# EAGLE design MotorDriver-rev1 (EAGLE 7.6.0)
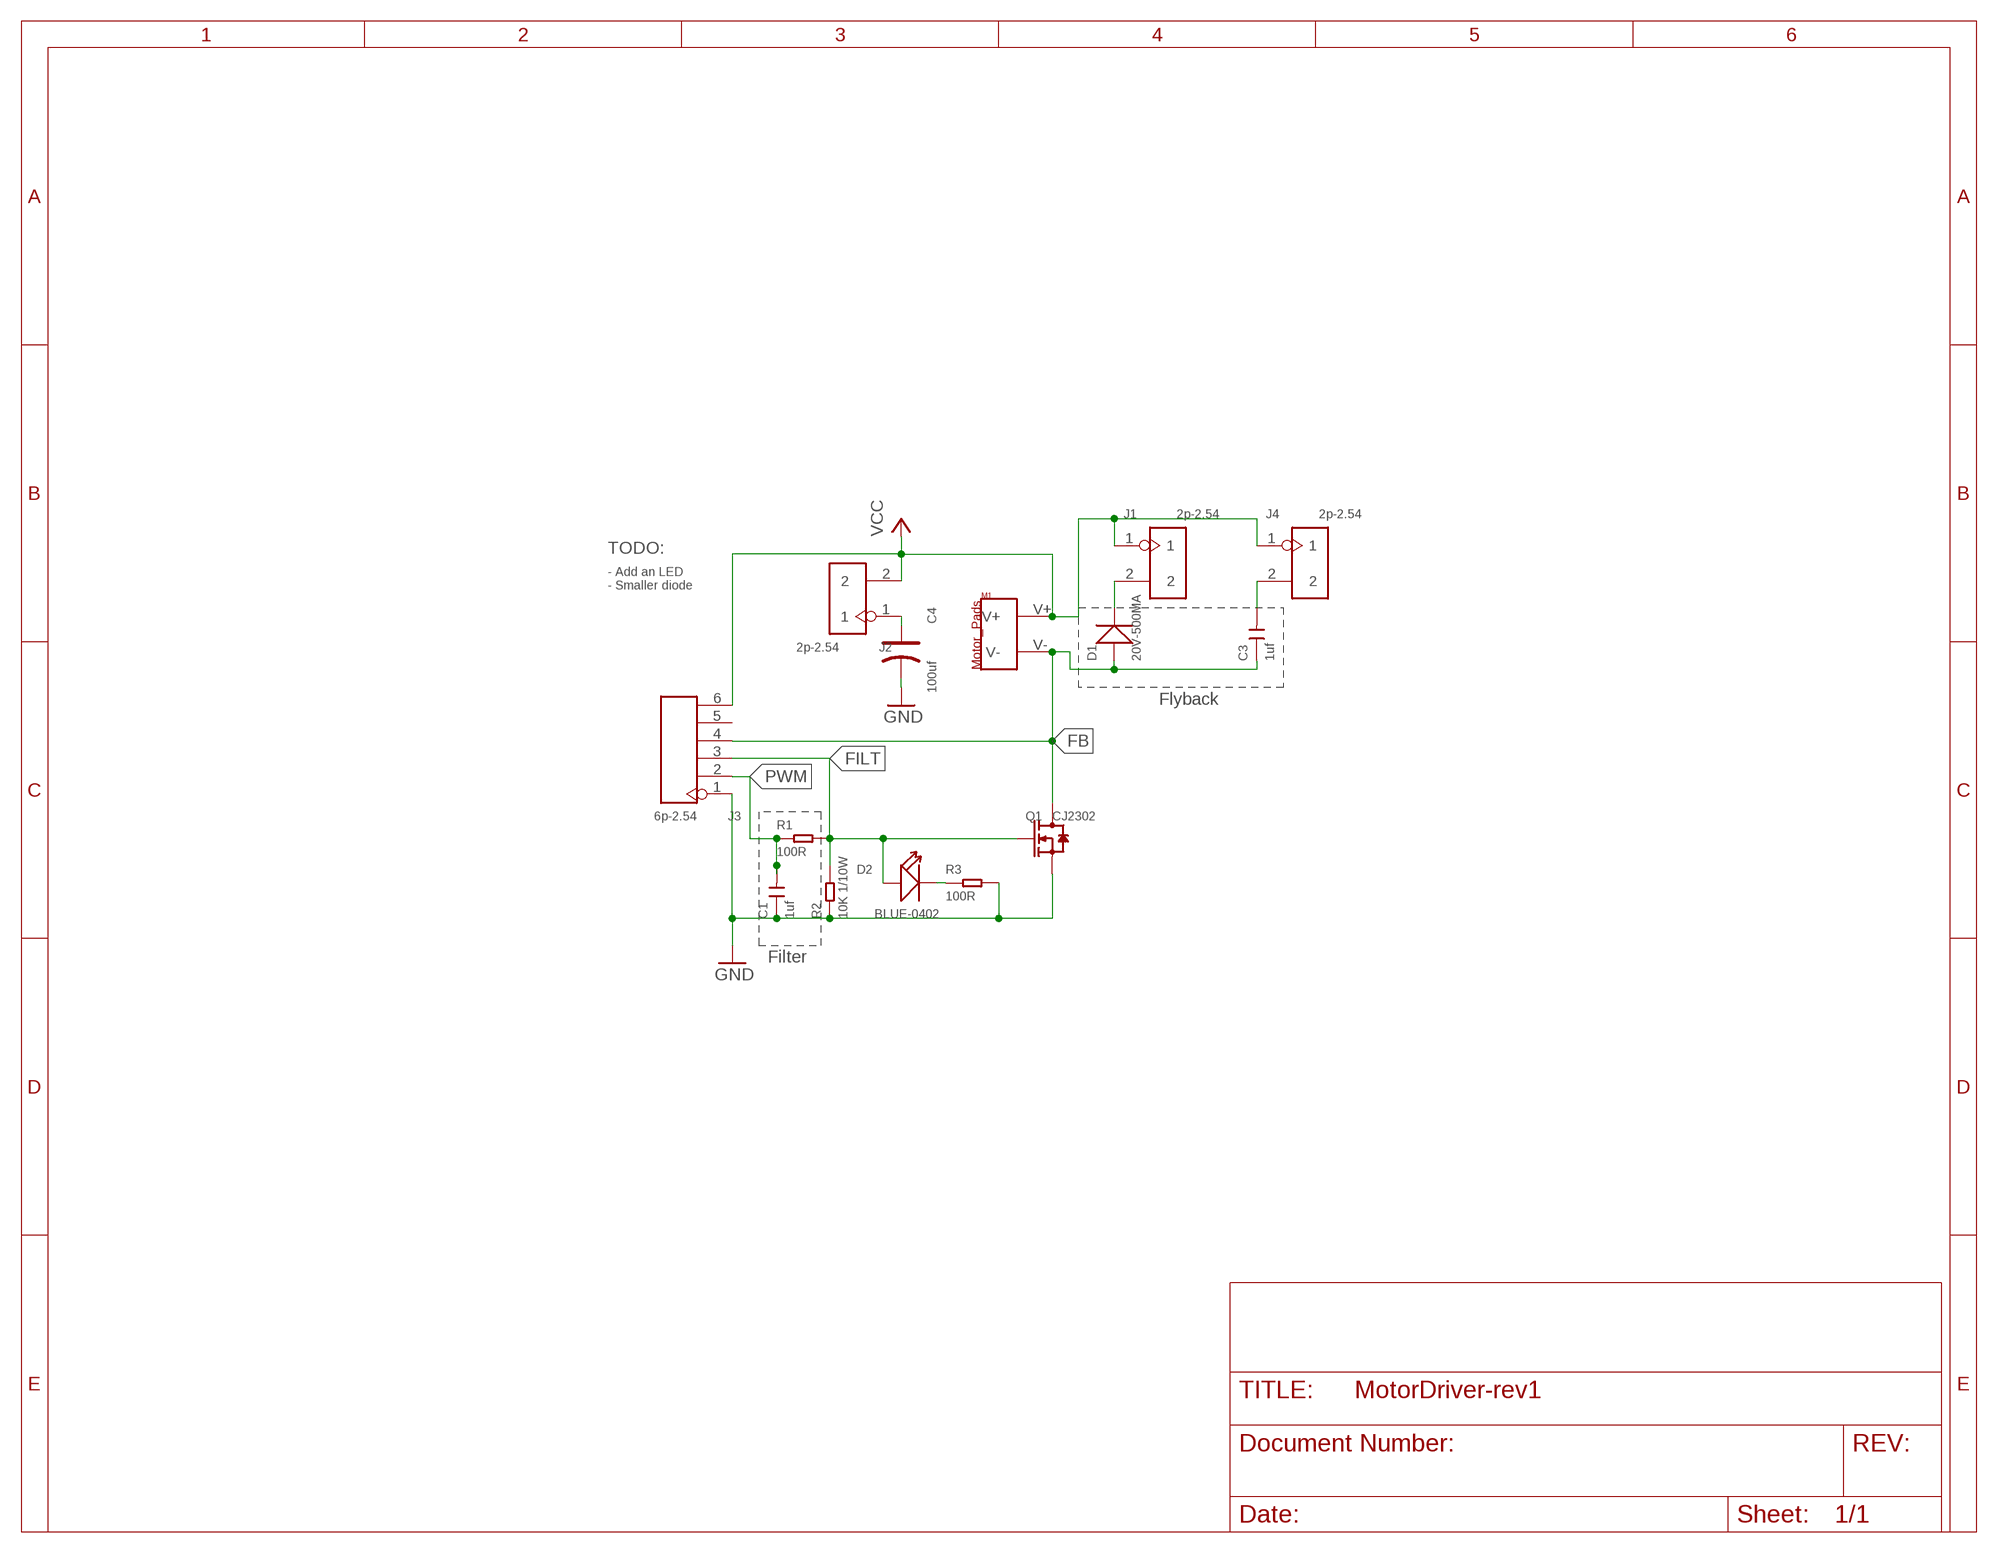
[diagram p0: schematic, sheet 1]

## Parts
C1  1uf  CERAMIC-1UF-10V-10%-X5R(0402)  [C0402]
C3  1uf  CERAMIC-1UF-25V-10%-X7R(0603)  [C0603]
C4  100uf  TANTALUM-SMD-100UF-10V(AVX-B)  [AVX-B]
D1  20V-500MA  SMD-DIODE-SCHOTTKY-20V-500MA(SOD-123)  [SOD-123]
D2  BLUE-0402  SMD-LED-CLEAR-BLUE(0402)  [LED-0402]
J1  2p-2.54  DIP-BLACK-MALE-HEADER-VERT(2P-2.54)  [H2-2.54]
J2  2p-2.54  DIP-BLACK-MALE-HEADER-VERT(2P-2.54)  [H2-2.54]
J3  6p-2.54  DIP-BLACK-MALE-HEADER(6P-2.54)  [H6-2.54]
J4  2p-2.54  DIP-BLACK-MALE-HEADER-VERT(2P-2.54)  [H2-2.54]
M1  MOTOR_PADS  [MOTOR_PADS]
Q1  CJ2302  SMD-MOSFET-N-CH-20V-2.1A-CJ2302(SOT-23)  [SOT-23]
R1  100R  SMD-RES-100R-5%-1/10W(0603)  [R0603]
R2  10K 1/10W  SMD-RES-10K-5%-1/10W(0603)  [R0603]
R3  100R  SMD-RES-100R-5%-1/16W(0402)  [R0402]

## Nets
FB [HighAmps]: C3.1 D1.+ J3.4 M1.V- Q1.3(D)
FILT: D2.+ J3.3 Q1.1(G) R1.2 R2.2
GND [HighAmps]: C1.1 C4.- J3.1 Q1.2(S) R2.1 R3.2
N$1: D2.- R3.1
N$5 [HighAmps]: C4.+ J2.1
N$7 [HighAmps]: D1.- J1.2
N$8 [HighAmps]: C3.2 J4.2
PWM: C1.2 J3.2 R1.1
VCC [HighAmps]: J1.1 J2.2 J3.6 J4.1 M1.V+
Unconnected: J3.5

## Notes on the sheet
- TODO:
- - Add an LED
  - Smaller diode
- Flyback
- Filter

## Library data of the parts
C1 = Seeed-Capacitor-2016:CERAMIC-1UF-10V-10%-X5R(0402): 302010040; MPN: CC0402KRX5R6BB105
C3 = Seeed-Capacitor-2016:CERAMIC-1UF-25V-10%-X7R(0603): 302010139; MPN: CC0603KRX7R8BB105
C4 = Seeed-Capacitor-2016:TANTALUM-SMD-100UF-10V(AVX-B): 302020015; MPN: TAJB107M010#NJ
D1 = Seeed-Diode-2016:SMD-DIODE-SCHOTTKY-20V-500MA(SOD-123): 304020032; MPN: SS0520-7-F
D2 = Seeed-LED-2016:SMD-LED-CLEAR-BLUE(0402): 304090075; MPN: BL-HB337A-AV-TRB
J1 J2 J4 = Seeed-Connector -2016:DIP-BLACK-MALE-HEADER-VERT(2P-2.54): 320020016; MPN: P125-1102A0BS116A1
J3 = Seeed-Connector -2016:DIP-BLACK-MALE-HEADER(6P-2.54): 320020078; MPN: P125-1106A1BS116A1
M1 = Andranik-Lab4:MOTOR_PADS
Q1 = Seeed-Transistor-2016:SMD-MOSFET-N-CH-20V-2.1A-CJ2302(SOT-23): 305030015; MPN: CJ2302
R1 = Seeed-Resistor-2016:SMD-RES-100R-5%-1/10W(0603): 301010090; MPN: RC0603JR-07100RL
R2 = Seeed-Resistor-2016:SMD-RES-10K-5%-1/10W(0603): 301010293; MPN: RC0603JR-0710KL
R3 = Seeed-Resistor-2016:SMD-RES-100R-5%-1/16W(0402): 301010028; MPN: RC0402JR-07100RL

## Net classes
1 HighAmps: width 0.762 mm

## Board
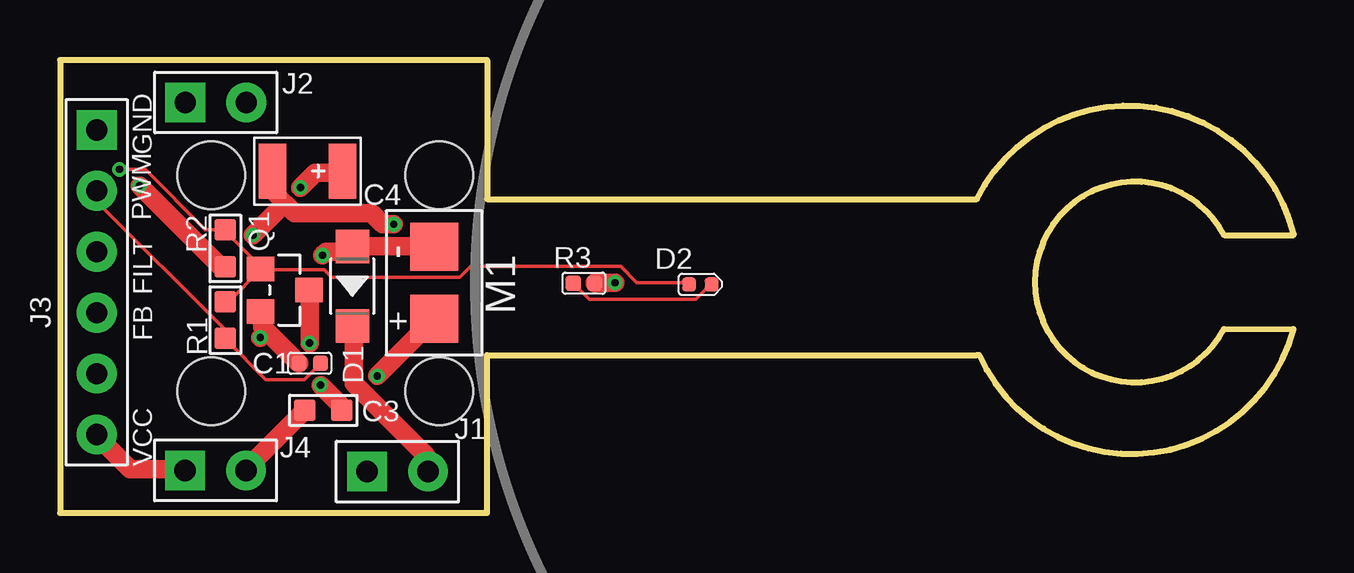
[diagram p1: board, top side]
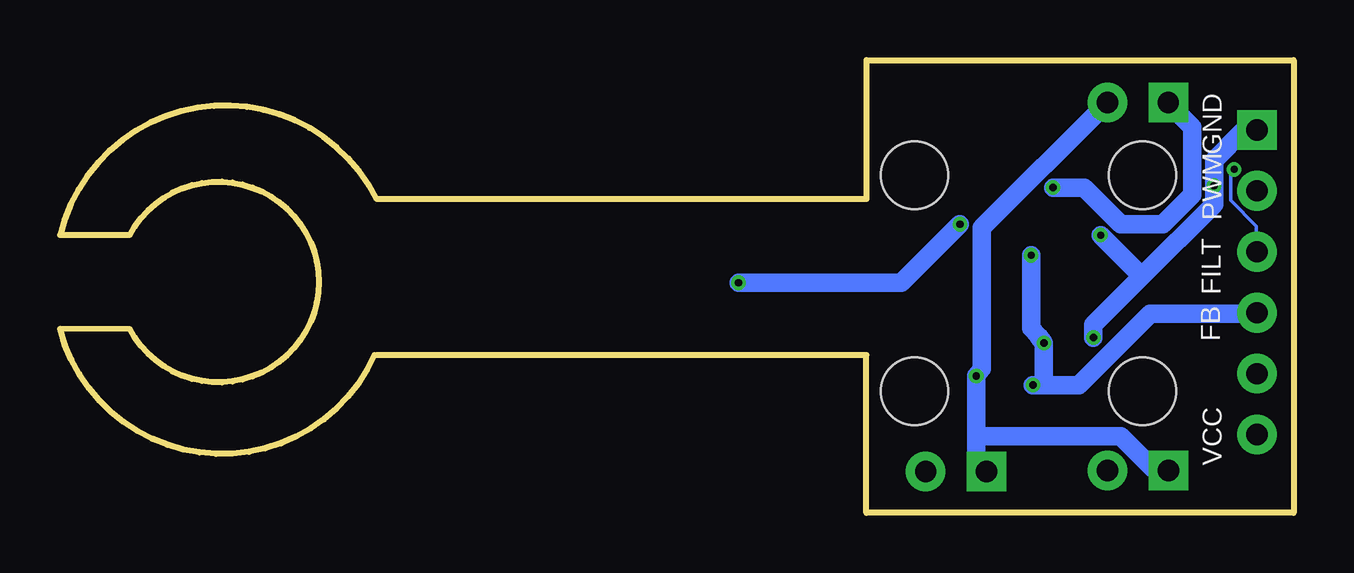
[diagram p2: board, bottom side, seen from below]

Size 51.4 x 18.87 mm. Coordinates in mm from the lower left corner, seen from the top.
Outline: 38.2,6.57 17.8,6.57 17.8,0 0,0 0,18.87 17.8,18.87 17.8,13.07 38.2,13.07 arc-140 51.4,11.57 48.5,11.57 arc304 48.5,7.67
Outline: 48.5,7.66 51.38,7.67
Outline: 38.3,6.57 arc141 51.4,7.67
Copper layers (1*16): Top 0.035mm / dielectric 1.5mm / Bottom 0.035mm
Design rules "SeeedStudio_2layer_DRU_no_angle_20140221": minimum track width 6mil, minimum drill 12mil, track to track 6mil, track to pad 6mil, pad to pad 6mil, via to via 6mil, smd to smd 0mil, copper to edge 10mil, drill to drill 10mil, minimum pad ring 10mil, minimum via ring 6mil, stop-mask expansion 2mil, vias tented up to drill 100mil, thermal gap 10mil
Holes 2.8 mm at 15.8,14.07 15.8,5.07 6.3,5.07 6.3,14.07

### Footprints (pad centres in the part's own frame; a part is rotated, then mirrored left to right if it is on the bottom)
C0402 = smd 0.635 x 0.635: 1 0,0.445; 2 0,-0.445
C0603 = smd 0.889 x 0.889: 1 0,0.762; 2 0,-0.762
AVX-B = smd 1.143 x 2.286: + -1.46,0; - 1.46,0
SOD-123 = smd 1.397 x 1.397: + -1.651,0; - 1.651,0
LED-0402 = smd 0.58 x 0.58: + -0.468,0; - 0.468,0
H2-2.54 = drill 0.889 pad 1.651 square: 1 0,1.27 | drill 0.889 pad 1.651: 2 0,-1.27
H6-2.54 = drill 0.889 pad 1.651 square: 1 0,6.35 | drill 0.889 pad 1.651: 2 0,3.81; 3 0,1.27; 4 0,-1.27; 5 0,-3.81; 6 0,-6.35
MOTOR_PADS = smd 2 x 2: V+ -1,0; V- 2,0
SOT-23 = smd 1.016 x 1.143: 1 -0.889,-1.016; 2 0.889,-1.016; 3 0,1.016
R0603 = smd 0.889 x 0.889: 1 0,0.762; 2 0,-0.762
R0402 = smd 0.635 x 0.635: 1 0,0.445; 2 0,-0.445

### Placement (x,y rotation side)
C1  10.41,6.23 90 top
C3  10.97,4.27 270 top
C4  10.32,14.23 180 top
D1  12.18,9.45 270 top
D2  26.68,9.52 0 top
J1  14.06,1.72 90 top
J2  6.49,17.1 90 top
J3  1.53,9.61 0 top
J4  6.48,1.77 90 top
M1  15.59,9.08 90 top
Q1  9.37,9.28 270 top
R1  6.89,8.03 180 top
R2  6.89,11.03 180 top
R3  21.83,9.57 90 top

### Tracks (layer width: path | path; a pad name or v marks a point on that pad's centre or on a via)
FB  (via drill 0.3)
  Top 0.762: M1.V- 15.58,11.11 12.23,11.11 D1.+ 11.85,10.88 11.09,10.88 v10.94,10.73 | v10.86,5.32 11.7,4.48 11.7,4.33 C3.1 | v10.4,7.07 10.4,9.21 Q1.3
  Bottom 0.762: 10.4,5.32 8.95,5.32 5.98,8.29 1.56,8.29 J3.4 | 10.4,5.32 v10.86,5.32 | 10.4,5.32 v10.4,7.07 10.63,7.38 10.94,7.69 v10.94,10.73
FILT  (via drill 0.3)
  Top 0.152: D2.+ 26.18,9.59 24.04,9.59 23.36,10.28 17.11,10.28 16.65,9.82 11.32,9.82 11.01,10.12 8.42,10.12 Q1.1 | R1.2 6.9,8.83 7.05,8.83 8.34,10.12 Q1.1 | Q1.1 8.42,10.2 6.9,11.72 R2.2 6.82,11.8 6.06,11.8 3.54,14.31 v2.48,14.31
  Bottom 0.152: v2.48,14.31 2.63,14.16 2.63,13.02 1.56,11.95 1.56,10.88 J3.3
GND  (via drill 0.3)
  Top 0.762: v23.13,9.59 22.29,9.59 R3.2 | v13.91,12.03 13.45,12.03 12.99,12.48 9.79,12.48 9.37,12.91 | 9.37,12.91 8.88,13.4 8.88,14.16 C4.- | 8.61,7.57 8.42,7.76 8.42,8.37 Q1.2 | 8.61,7.57 9.94,6.24 C1.1 | v3.32,13.63 6.67,10.28 6.82,10.28 R2.1 | v8.34,7.3 8.61,7.57 | v8.04,11.57 9.37,12.91
  Bottom 0.762: v23.13,9.59 16.34,9.59 v13.91,12.03 | J3.1 1.56,15.91 2.09,15.91 3.32,14.7 v3.32,13.63 3.32,12.87 6.32,9.86 | v8.34,7.3 8.34,7.84 6.32,9.86 | 6.32,9.86 v8.04,11.57
N$1
  Top 0.152: D2.- 27.09,9.51 26.48,8.9 22.06,8.9 21.45,9.51 R3.1
N$5  (via drill 0.3)
  Top 0.762: v10.02,13.55 10.63,14.16 11.77,14.16 C4.+
  Bottom 0.762: v10.02,13.55 8.72,13.55 7.2,12.03 5.45,12.03 4.23,13.25 4.23,16.07 5.22,17.06 J2.1
N$7
  Top 0.762: D1.- 12.23,7.76 12.23,5.4 15.28,2.35 15.28,1.74 J1.2
N$8
  Top 0.762: C3.2 10.17,4.26 7.73,1.82 J4.2
PWM
  Top 0.152: C1.2 10.78,6.16 10.17,5.55 8.57,5.55 6.9,7.23 R1.1 6.82,7.3 6.82,7.69 1.56,12.94 1.56,13.4 J3.2
VCC  (via drill 0.3)
  Top 0.762: J4.1 5.14,1.82 2.93,1.82 1.56,3.19 J3.6 | v13.22,5.7 15.58,8.07 M1.V+
  Bottom 0.762: 13.22,3.19 13.22,2.12 12.84,1.74 J1.1 | 13.22,3.19 v13.22,5.7 12.99,6.01 12.99,11.88 7.81,17.06 J2.2 | 13.22,3.19 7.2,3.19 5.83,1.82 5.22,1.82 J4.1

### Text on the board
tPlace: GND | PWM | FILT | FB | VCC
bPlace: GND | PWM | FILT | FB | VCC